# EAGLE schematic rapidshark-half-assed-full-h-bridge-mk-1.0 (EAGLE 7.5.0)
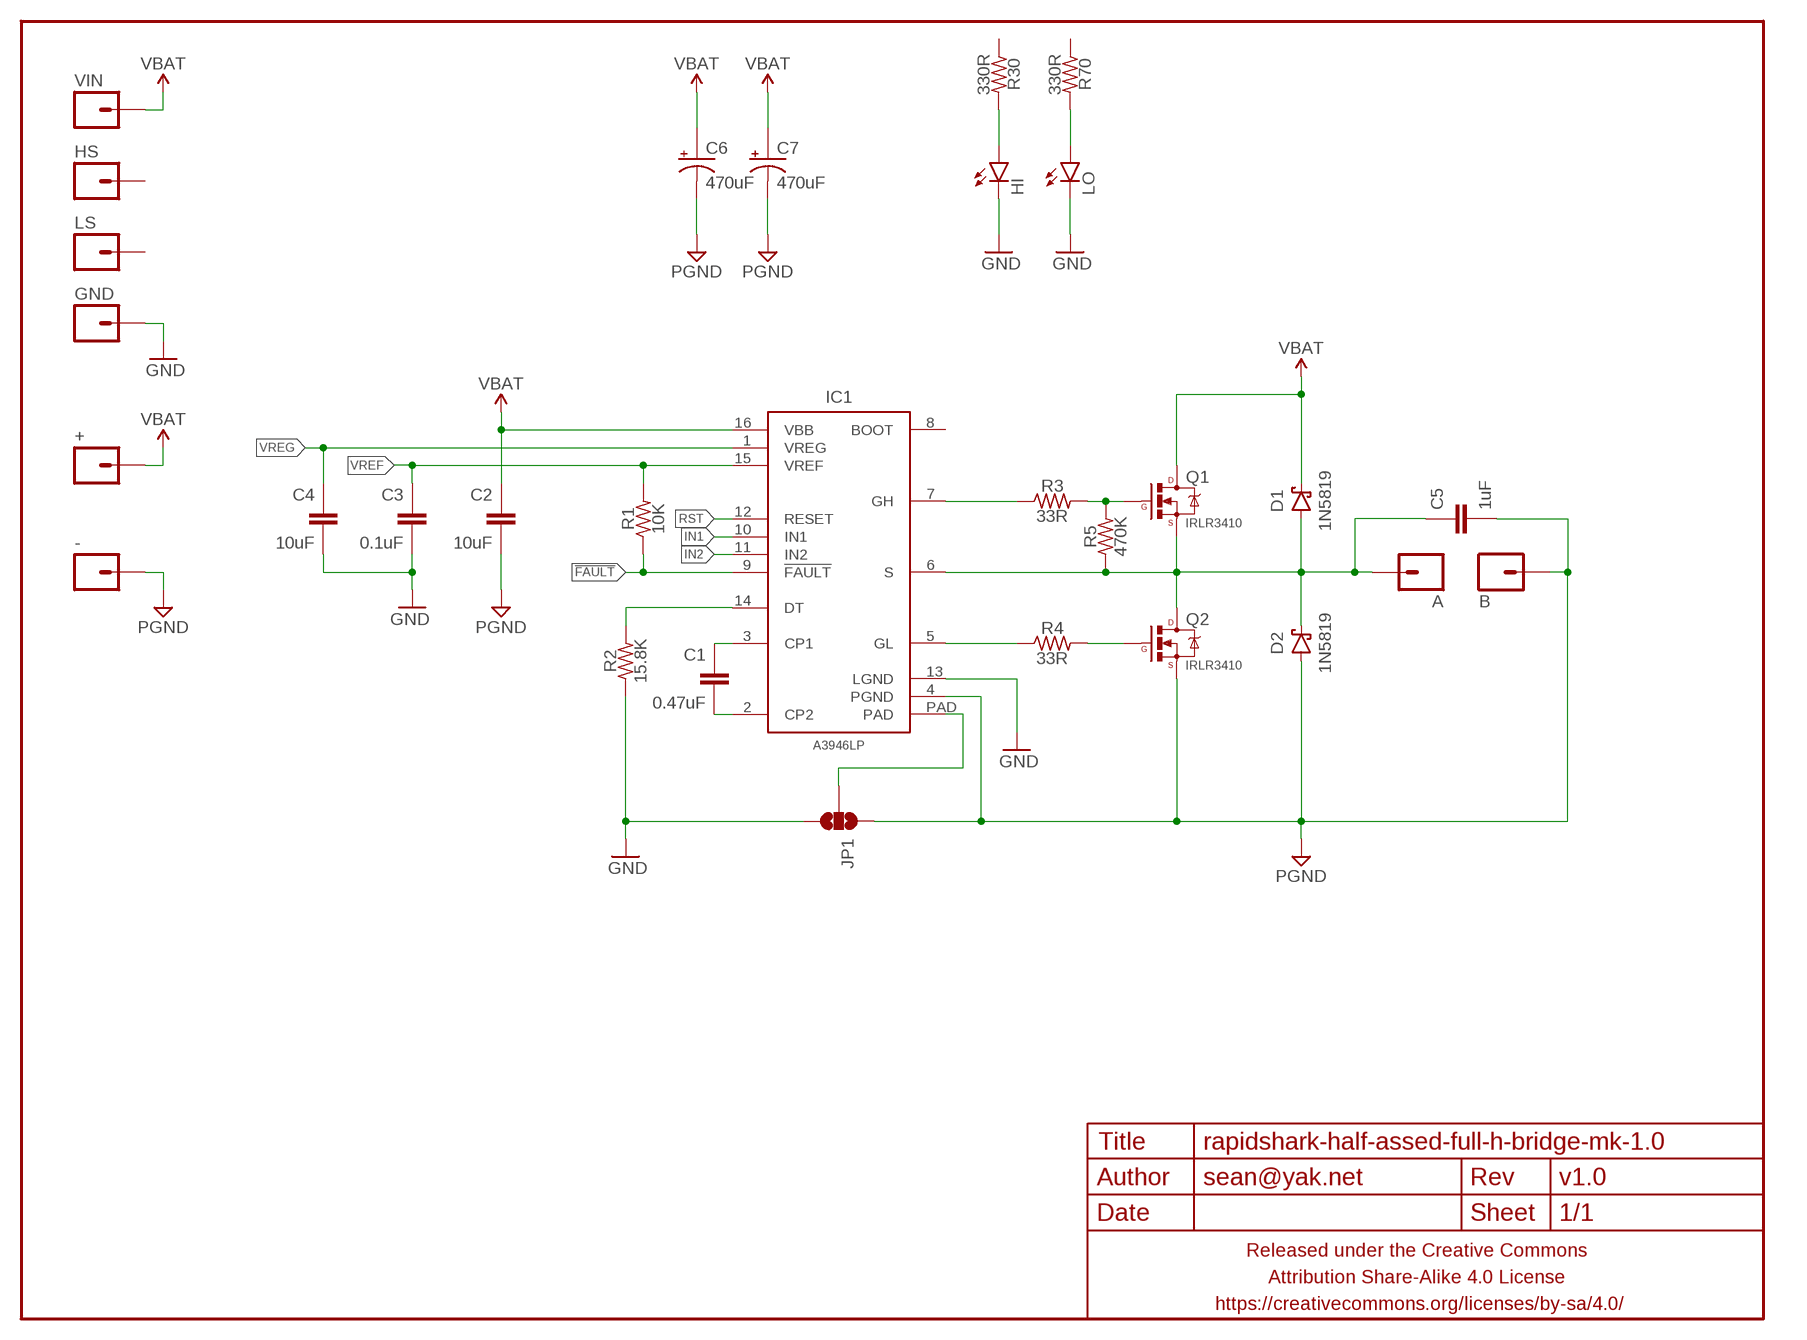
[diagram p0: schematic, sheet 1]

## Parts
+  M01PTH-1.9MM  [1X01-1.9MM-CIR]
-  M01PTH-1.9MM  [1X01-1.9MM-CIR]
A  M01PTH-1.9MM  [1X01-1.9MM-CIR]
B  M01PTH-1.9MM  [1X01-1.9MM-CIR]
C1  0.47uF  CAPACITOR-CERAMICC0603-TIGHTER  [C0603-TIGHTER]
C2  10uF  CAPACITOR-CERAMICC0805-TIGHTER  [C0805-TIGHTER]
C3  0.1uF  CAPACITOR-CERAMICC0603-TIGHTER  [C0603-TIGHTER]
C4  10uF  CAPACITOR-CERAMICC0805-TIGHTER  [C0805-TIGHTER]
C5  1uF  CAPACITOR-CERAMICC0603-TIGHTER  [C0603-TIGHTER]
C6  470uF  CAPACITOR-POLARIZEDE5-10.5  [E5-10,5]
C7  470uF  CAPACITOR-POLARIZEDE5-10.5  [E5-10,5]
D1  1N5819  DIODE-SCHOTTKYSMA  [SMA-DIODE-SCHOTTKY]
D2  1N5819  DIODE-SCHOTTKYSMA  [SMA-DIODE-SCHOTTKY]
FRAME1  FRAME-LETTERNO_PACKAGE  [DUMMY]
GND  M01PTH  [1X01]
HI  LED0603-TIGHT  [LED-0603-TIGHT]
HS  M01PTH  [1X01]
IC1  A3946LP  [TSSOP-16-PAD]
JP1  JUMPER-PAD-3-NOFULL_BOX_SILK  [PAD-JUMPER-3-NO_YES_SILK_FULL_BOX]
LO  LED0603-TIGHT  [LED-0603-TIGHT]
LS  M01PTH  [1X01]
Q1  IRLR3410  MOSFET-NCHANNELFDD8780  [DPAK]
Q2  IRLR3410  MOSFET-NCHANNELFDD8780  [DPAK]
R1  10K  RESISTORR0603-TIGHTER  [R0603-TIGHTER]
R2  15.8K  RESISTORR0603-TIGHTER  [R0603-TIGHTER]
R3  33R  RESISTORR0603-TIGHTER  [R0603-TIGHTER]
R4  33R  RESISTORR0603-TIGHTER  [R0603-TIGHTER]
R5  470K  RESISTORR0603-TIGHTER  [R0603-TIGHTER]
R30  330R  RESISTORR0603-TIGHTER  [R0603-TIGHTER]
R70  330R  RESISTORR0603-TIGHTER  [R0603-TIGHTER]
VIN  M01PTH  [1X01]

## Nets
!FAULT: IC1.9(!FAULT) R1.1
A: A.P$1 C5.1 D1.A D2.C IC1.6(S) Q1.3(S) Q2.4(D) R5.1
GND: C3.2 C4.2 GND.1 HI.C IC1.13(LGND) JP1.3 LO.C R2.1
IN1: IC1.10(IN1)
IN2: IC1.11(IN2)
N$1: Q2.1(G) R4.2
N$2: C1.1 IC1.3(CP1)
N$3: LO.A R70.2
N$4: HI.A R30.2
N$5: Q1.1(G) R3.2 R5.2
N$6: C1.2 IC1.2(CP2)
N$7: IC1.14(DT) R2.2
N$8: IC1.PAD JP1.2
N$11: IC1.5(GL) R4.1
N$12: IC1.7(GH) R3.1
PGND: -.P$1 B.P$1 C2.2 C5.2 C6.- C7.- D2.A IC1.4(PGND) JP1.1 Q2.3(S)
RST: IC1.12(RESET)
VBAT: +.P$1 C2.1 C6.+ C7.+ D1.C IC1.16(VBB) Q1.4(D) VIN.1
VREF: C3.1 IC1.15(VREF) R1.2
VREG: C4.1 IC1.1(VREG)
Unconnected: HS.1 IC1.8(BOOT) LS.1 R30.1 R70.1

## Library data of the parts
+ - A B GND HS LS VIN = a_parts:M01: Header 1 Standard 1-pin 0.1" header. Use with straight break away headers (SKU : PRT-00116), right angle break away headers (PRT-00553), swiss pins (PRT-00743), machine pins (PRT-00117), and female headers (PRT-00115).
C1-C5 = a_parts:CAPACITOR-CERAMIC: CAPACITOR, European symbol
C6 C7 = a_parts:CAPACITOR-POLARIZED: POLARIZED CAPACITOR, American symbol
D1 D2 = a_parts:DIODE-SCHOTTKY: Schottky diodes in SFE's production catalog BAT20J 1A 23V 0.62Vf RB751 120mA 40V 0.37Vf PMEG4005EJ 0.5A 40V 0.42Vf MBRA140 1A 40V 0.5Vf B340A 3A 40V SMA
FRAME1 = A_butts:FRAME-LETTER: Schematic Frame Standard 8.5x11 US Letter frame; DESIGNER: sean@yak.net; VERSION: v1.0
HI LO = a_parts:LED: LEDs Standard schematic elements and footprints for 5mm, 3mm, 1206, and 0603 sized LEDs. 5mm - Spark Fun Electronics SKU : COM-00529 (and others)
IC1 = a_parts:A3946
JP1 = a_parts:JUMPER-PAD-3-NO
Q1 Q2 = a_parts:MOSFET-NCHANNEL: Common NMOSFET Parts MFG P/N Store ID Prod ID FDD8780 TRANS-09984 SI7820DN TRANS-11055 FDS6630A IC-08089 2N7002PW TRANS-11151 FQP30N06L COM-10213 TRANS-10060 BSS123LT1G TRANS-08345 BSS138 TRANS-00830 BS170 2N7000; PROD_ID: TRANS-09984
R1-R5 R30 R70 = a_parts:RESISTOR: RESISTOR, American symbol